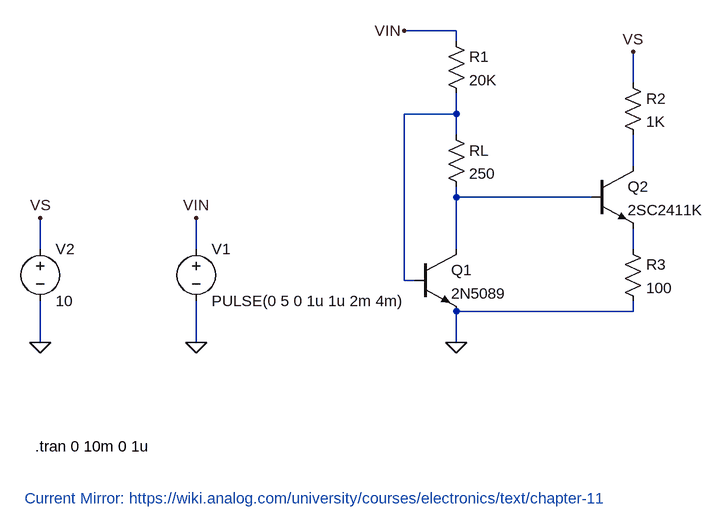
[diagram p0: schematic Draft16.asc]
Draft16.asc, the LTspice schematic file:
Version 4
SHEET 1 880 680
WIRE 464 -224 384 -224
WIRE 464 -208 464 -224
WIRE 736 -144 736 -192
WIRE 464 -96 464 -128
WIRE 464 -96 384 -96
WIRE 464 -64 464 -96
WIRE 736 -16 736 -64
WIRE 464 32 464 16
WIRE 672 32 464 32
WIRE -176 112 -176 64
WIRE 64 112 64 64
WIRE 464 112 464 32
WIRE 736 112 736 80
WIRE 384 160 384 -96
WIRE 400 160 384 160
WIRE 736 208 736 192
WIRE 736 208 464 208
WIRE -176 256 -176 192
WIRE 64 256 64 192
WIRE 464 256 464 208
FLAG 464 256 0
FLAG 64 64 VIN
FLAG 64 256 0
FLAG 384 -224 VIN
FLAG -176 256 0
FLAG -176 64 VS
FLAG 736 -192 VS
SYMBOL voltage 64 96 R0
WINDOW 123 0 0 Left 0
WINDOW 39 0 0 Left 0
SYMATTR InstName V1
SYMATTR Value PULSE(0 5 0 1u 1u 2m 4m)
SYMBOL npn 400 112 R0
SYMATTR InstName Q1
SYMATTR Value 2N5089
SYMBOL npn 672 -16 R0
SYMATTR InstName Q2
SYMATTR Value 2SC2411K
SYMBOL res 448 -80 R0
SYMATTR InstName RL
SYMATTR Value 250
SYMBOL res 448 -224 R0
SYMATTR InstName R1
SYMATTR Value 20K
SYMBOL res 720 -160 R0
SYMATTR InstName R2
SYMATTR Value 1K
SYMBOL voltage -176 96 R0
SYMATTR InstName V2
SYMATTR Value 10
SYMBOL res 720 96 R0
SYMATTR InstName R3
SYMATTR Value 100
TEXT -184 416 Left 2 !.tran 0 10m 0 1u
TEXT -200 496 Left 2 ;Current Mirror: https://wiki.analog.com/university/courses/electronics/text/chapter-11

The netlist it stands for:
* Draft16.asc
V1 VIN 0 PULSE(0 5 0 1u 1u 2m 4m)
Q1 N003 N001 0 0 2N5089
Q2 N002 N003 N004 0 2SC2411K
RL N001 N003 250
R1 VIN N001 20K
R2 VS N002 1K
V2 VS 0 10
R3 N004 0 100
.model NPN NPN
.model PNP PNP
.lib standard.bjt
.tran 0 10m 0 1u
* Current Mirror: https://wiki.analog.com/university/courses/electronics/text/chapter-11
.backanno
.end